# Altium schematic sheet 3.3M_Transistor_Logic.SchDoc
size A4
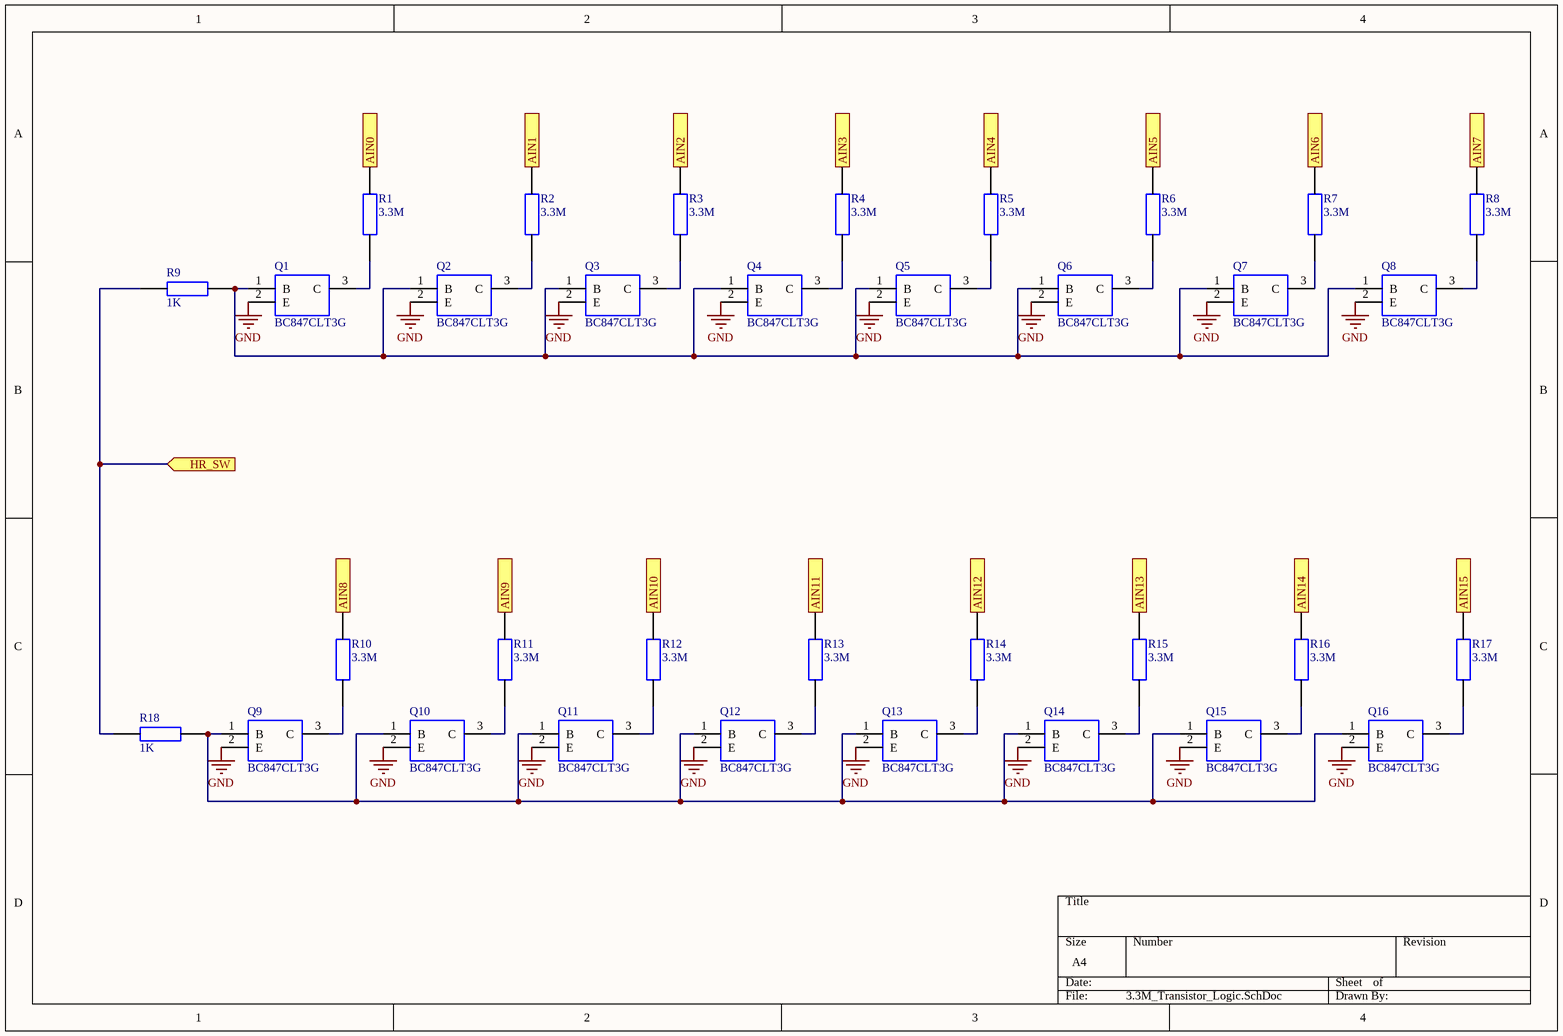
[diagram p0: 3.3M_Transistor_Logic.SchDoc]

## Parts
Q1  BC847CLT3G  [SOT96P237X111-3N]
Q2  BC847CLT3G  [SOT96P237X111-3N]
Q3  BC847CLT3G  [SOT96P237X111-3N]
Q4  BC847CLT3G  [SOT96P237X111-3N]
Q5  BC847CLT3G  [SOT96P237X111-3N]
Q6  BC847CLT3G  [SOT96P237X111-3N]
Q7  BC847CLT3G  [SOT96P237X111-3N]
Q8  BC847CLT3G  [SOT96P237X111-3N]
Q9  BC847CLT3G  [SOT96P237X111-3N]
Q10  BC847CLT3G  [SOT96P237X111-3N]
Q11  BC847CLT3G  [SOT96P237X111-3N]
Q12  BC847CLT3G  [SOT96P237X111-3N]
Q13  BC847CLT3G  [SOT96P237X111-3N]
Q14  BC847CLT3G  [SOT96P237X111-3N]
Q15  BC847CLT3G  [SOT96P237X111-3N]
Q16  BC847CLT3G  [SOT96P237X111-3N]
R1  3.3M  [RESC1608X55N]
R2  3.3M  [RESC1608X55N]
R3  3.3M  [RESC1608X55N]
R4  3.3M  [RESC1608X55N]
R5  3.3M  [RESC1608X55N]
R6  3.3M  [RESC1608X55N]
R7  3.3M  [RESC1608X55N]
R8  3.3M  [RESC1608X55N]
R9  1K  [RESC1608X55N]
R10  3.3M  [RESC1608X55N]
R11  3.3M  [RESC1608X55N]
R12  3.3M  [RESC1608X55N]
R13  3.3M  [RESC1608X55N]
R14  3.3M  [RESC1608X55N]
R15  3.3M  [RESC1608X55N]
R16  3.3M  [RESC1608X55N]
R17  3.3M  [RESC1608X55N]
R18  1K  [RESC1608X55N]

## Ports
AIN0 (out), AIN1 (out), AIN2 (out), AIN3 (out), AIN4 (out), AIN5 (out), AIN6 (out), AIN7 (out), AIN8 (out), AIN9 (out), AIN10 (out), AIN11 (out), AIN12 (out), AIN13 (out), AIN14 (out), AIN15 (out), HR_SW (in)

## Nets
GND: Q1.2(E) Q2.2(E) Q3.2(E) Q4.2(E) Q5.2(E) Q6.2(E) Q7.2(E) Q8.2(E) Q9.2(E) Q10.2(E) Q11.2(E) Q12.2(E) Q13.2(E) Q14.2(E) Q15.2(E) Q16.2(E)
AIN0: R1.2 ; port AIN0
AIN1: R2.2 ; port AIN1
AIN2: R3.2 ; port AIN2
AIN3: R4.2 ; port AIN3
AIN4: R5.2 ; port AIN4
AIN5: R6.2 ; port AIN5
AIN6: R7.2 ; port AIN6
AIN7: R8.2 ; port AIN7
AIN8: R10.2 ; port AIN8
AIN9: R11.2 ; port AIN9
AIN10: R12.2 ; port AIN10
AIN11: R13.2 ; port AIN11
AIN12: R14.2 ; port AIN12
AIN13: R15.2 ; port AIN13
AIN14: R16.2 ; port AIN14
AIN15: R17.2 ; port AIN15
HR_SW: R9.1 R18.1 ; port HR_SW
NetQ1_1: Q1.1(B) Q2.1(B) Q3.1(B) Q4.1(B) Q5.1(B) Q6.1(B) Q7.1(B) Q8.1(B) R9.2
NetQ1_3: Q1.3(C) R1.1
NetQ2_3: Q2.3(C) R2.1
NetQ3_3: Q3.3(C) R3.1
NetQ4_3: Q4.3(C) R4.1
NetQ5_3: Q5.3(C) R5.1
NetQ6_3: Q6.3(C) R6.1
NetQ7_3: Q7.3(C) R7.1
NetQ8_3: Q8.3(C) R8.1
NetQ9_1: Q9.1(B) Q10.1(B) Q11.1(B) Q12.1(B) Q13.1(B) Q14.1(B) Q15.1(B) Q16.1(B) R18.2
NetQ9_3: Q9.3(C) R10.1
NetQ10_3: Q10.3(C) R11.1
NetQ11_3: Q11.3(C) R12.1
NetQ12_3: Q12.3(C) R13.1
NetQ13_3: Q13.3(C) R14.1
NetQ14_3: Q14.3(C) R15.1
NetQ15_3: Q15.3(C) R16.1
NetQ16_3: Q16.3(C) R17.1

## Library data of the parts
Q1-Q16 = BC847CLT3G: Manufacturer_Name: ON Semiconductor; Geometry.Height: 1.11mm; Manufacturer_Part_Number: BC847CLT3G; Arrow Part Number: BC847CLT3G; Arrow Price/Stock: https://www.arrow.com/en/products/bc847clt3g/on-semiconductor; Mouser Part Number: 863-BC847CLT3G; Mouser Price/Stock: https://www.mouser.co.uk/ProductDetail/ON-Semiconductor/BC847CLT3G?qs=vNc2DXHODiIVMr372epecQ%3D%3D; Datasheet Link: http://www.onsemi.com/pub/Collateral/BC846ALT1-D.PDF
R1-R8 R10-R17 = RC0603FR-07330RL: YAGEO (PHYCOMP) - RC0603FR-07330RL - RES, THICK FILM, 330R, 1%, 0.1W, 0603; Geometry.Height: 0.55mm; Manufacturer_Name: YAGEO (PHYCOMP); Manufacturer_Part_Number: RC0603FR-07330RL; Arrow Part Number: RC0603FR-07330RL; Arrow Price/Stock: https://www.arrow.com/en/products/rc0603fr-07330rl/yageo; Mouser Part Number: 603-RC0603FR-07330RL; Mouser Price/Stock: https://www.mouser.co.uk/ProductDetail/Yageo/RC0603FR-07330RL?qs=diQw95jMAeN1335dAOzMfg%3D%3D; Datasheet Link: http://www.yageo.com/documents/recent/PYu-RC0603_51_RoHS_L_v5.pdf
R9 R18 = RC0603JR-071KL: YAGEO (PHYCOMP) - RC0603JR-071KL - RES, THICK FILM, 1K, 5%, 0.1W, 0603; Geometry.Height: 0.55mm; Manufacturer_Name: YAGEO (PHYCOMP); Manufacturer_Part_Number: RC0603JR-071KL; Arrow Part Number: RC0603JR-071KL; Arrow Price/Stock: https://www.arrow.com/en/products/rc0603jr-071kl/yageo; Mouser Part Number: 603-RC0603JR-071KL; Mouser Price/Stock: https://www.mouser.co.uk/ProductDetail/Yageo/RC0603JR-071KL?qs=%2F9ZTgpVJnN7bctK4R%2FDEoA%3D%3D; Datasheet Link: http://www.yageo.com/documents/recent/PYu-RC0603_51_RoHS_L_v5.pdf